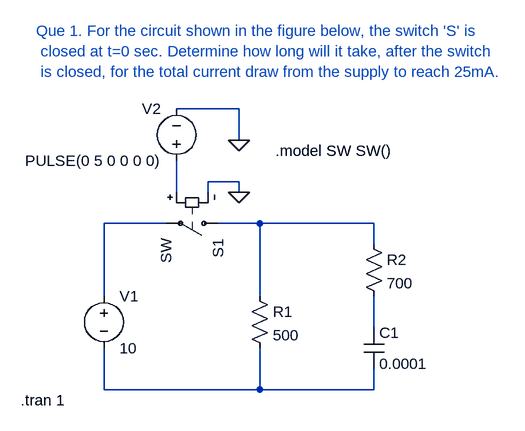
[diagram p0: schematic 1_Dheerendra_23EE019_Transient.asc]
1_Dheerendra_23EE019_Transient.asc, the LTspice schematic file:
Version 4
SHEET 1 880 680
WIRE 272 -160 176 -160
WIRE 272 -112 272 -160
WIRE 272 -48 224 -48
WIRE 176 -32 176 -80
WIRE 224 -32 224 -48
WIRE 272 -32 272 -48
WIRE 160 16 64 16
WIRE 304 16 240 16
WIRE 480 16 304 16
WIRE 480 48 480 16
WIRE 64 128 64 16
WIRE 304 128 304 16
WIRE 480 176 480 128
WIRE 64 272 64 208
WIRE 304 272 304 208
WIRE 304 272 64 272
WIRE 480 272 480 240
WIRE 480 272 304 272
FLAG 272 -32 0
FLAG 272 -112 0
SYMBOL voltage 64 112 R0
WINDOW 123 0 0 Left 0
WINDOW 39 0 0 Left 0
SYMATTR InstName V1
SYMATTR Value 10
SYMBOL res 288 112 R0
SYMATTR InstName R1
SYMATTR Value 500
SYMBOL res 464 32 R0
SYMATTR InstName R2
SYMATTR Value 700
SYMBOL sw 256 16 R90
SYMATTR InstName S1
SYMBOL voltage 176 -64 R180
WINDOW 0 24 96 Left 2
WINDOW 3 24 16 Left 2
WINDOW 123 0 0 Left 0
WINDOW 39 0 0 Left 0
SYMATTR InstName V2
SYMATTR Value PULSE(0 5 0 0 0 0)
SYMBOL cap 464 176 R0
SYMATTR InstName C1
SYMATTR Value 0.0001
TEXT -40 -280 Left 2 ;Que 1. For the circuit shown in the figure below, the switch 'S' is\n closed at t=0 sec. Determine how long will it take, after the switch\n is closed, for the total current draw from the supply to reach 25mA.
TEXT 328 -96 Left 2 !.model SW SW()
TEXT -64 288 Left 2 !.tran 1

The netlist it stands for:
* 1_Dheerendra_23EE019_Transient.asc
V1 N002 N005 10
R1 N003 N005 500
R2 N003 N004 700
S1 N003 N002 N001 0 SW
V2 N001 0 PULSE(0 5 0 0 0 0)
C1 N004 N005 0.0001
* Que 1. For the circuit shown in the figure below, the switch 'S' is
*  closed at t=0 sec. Determine how long will it take, after the switch
*  is closed, for the total current draw from the supply to reach 25mA.
.model SW SW()
.tran 1
.backanno
.end